# Altium schematic sheet Sheet2.SchDoc
size B
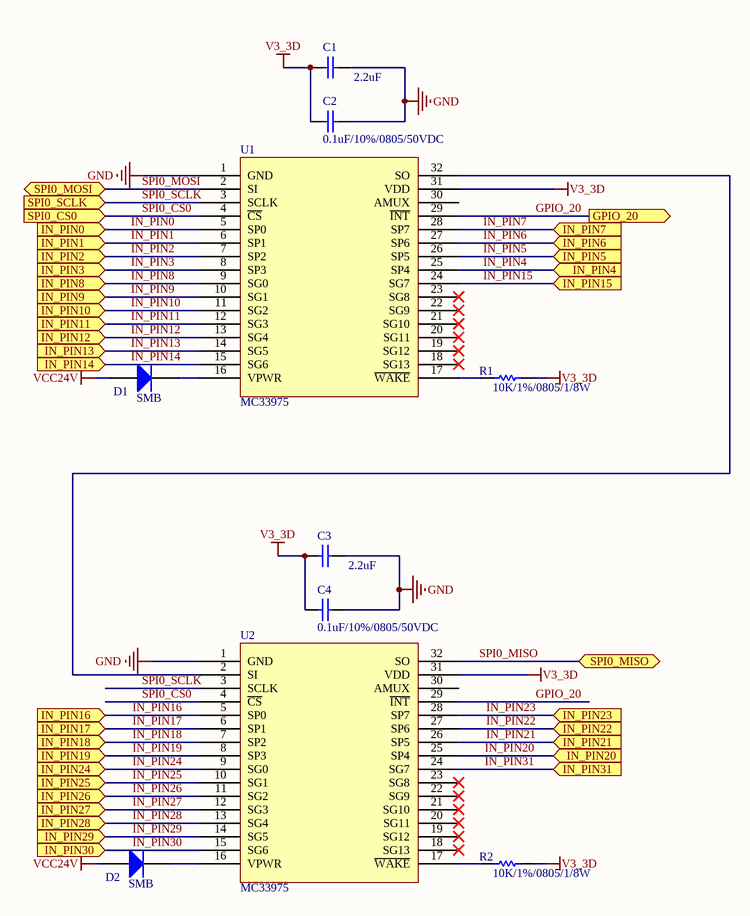
[diagram p0: Sheet2.SchDoc]

## Parts
C1  2.2uF  [0805_cap]
C2  0.1uF/10%/0805/50VDC  [0805_cap]
C3  2.2uF  [0805_cap]
C4  0.1uF/10%/0805/50VDC  [0805_cap]
D1  SMB  [SMB]
D2  SMB  [SMB]
R1  10K/1%/0805/1/8W  [0805]
R2  10K/1%/0805/1/8W  [0805]
U1  MC33975  [SOIC-32]
U2  MC33975  [SOIC-32]

## Ports
GPIO_20 (out), IN_PIN0 (in), IN_PIN1 (in), IN_PIN2 (in), IN_PIN3 (in), IN_PIN4 (in), IN_PIN5 (in), IN_PIN6 (in), IN_PIN7 (in), IN_PIN8 (in), IN_PIN9 (in), IN_PIN10 (in), IN_PIN11 (in), IN_PIN12 (in), IN_PIN13 (in), IN_PIN14 (in), IN_PIN15 (in), IN_PIN16 (in), IN_PIN17 (in), IN_PIN18 (in), IN_PIN19 (in), IN_PIN20 (in), IN_PIN21 (in), IN_PIN22 (in), IN_PIN23 (in), IN_PIN24 (in), IN_PIN25 (in), IN_PIN26 (in), IN_PIN27 (in), IN_PIN28 (in), IN_PIN29 (in), IN_PIN30 (in), IN_PIN31 (in), SPI0_CS0 (in), SPI0_MISO (bidir), SPI0_MOSI (bidir), SPI0_SCLK (in)

## Nets
GND: C1.1 C2.1 C3.1 C4.1 U1.1(GND) U2.1(GND)
V3_3D: C1.2 C2.2 C3.2 C4.2 R1.1 R2.1 U1.31(VDD) U2.31(VDD)
VCC24V: D1.1(A) D2.1(A)
GPIO_20: U1.29(~{INT}) U2.29(~{INT}) ; port GPIO_20
IN_PIN0: U1.5(SP0) ; port IN_PIN0
IN_PIN1: U1.6(SP1) ; port IN_PIN1
IN_PIN2: U1.7(SP2) ; port IN_PIN2
IN_PIN3: U1.8(SP3) ; port IN_PIN3
IN_PIN4: U1.25(SP4) ; port IN_PIN4
IN_PIN5: U1.26(SP5) ; port IN_PIN5
IN_PIN6: U1.27(SP6) ; port IN_PIN6
IN_PIN7: U1.28(SP7) ; port IN_PIN7
IN_PIN8: U1.9(SG0) ; port IN_PIN8
IN_PIN9: U1.10(SG1) ; port IN_PIN9
IN_PIN10: U1.11(SG2) ; port IN_PIN10
IN_PIN11: U1.12(SG3) ; port IN_PIN11
IN_PIN12: U1.13(SG4) ; port IN_PIN12
IN_PIN13: U1.14(SG5) ; port IN_PIN13
IN_PIN14: U1.15(SG6) ; port IN_PIN14
IN_PIN15: U1.24(SG7) ; port IN_PIN15
IN_PIN16: U2.5(SP0) ; port IN_PIN16
IN_PIN17: U2.6(SP1) ; port IN_PIN17
IN_PIN18: U2.7(SP2) ; port IN_PIN18
IN_PIN19: U2.8(SP3) ; port IN_PIN19
IN_PIN20: U2.25(SP4) ; port IN_PIN20
IN_PIN21: U2.26(SP5) ; port IN_PIN21
IN_PIN22: U2.27(SP6) ; port IN_PIN22
IN_PIN23: U2.28(SP7) ; port IN_PIN23
IN_PIN24: U2.9(SG0) ; port IN_PIN24
IN_PIN25: U2.10(SG1) ; port IN_PIN25
IN_PIN26: U2.11(SG2) ; port IN_PIN26
IN_PIN27: U2.12(SG3) ; port IN_PIN27
IN_PIN28: U2.13(SG4) ; port IN_PIN28
IN_PIN29: U2.14(SG5) ; port IN_PIN29
IN_PIN30: U2.15(SG6) ; port IN_PIN30
IN_PIN31: U2.24(SG7) ; port IN_PIN31
SPI0_CS0: U1.4(~{CS}) U2.4(~{CS}) ; port SPI0_CS0
SPI0_MISO: U2.32(SO) ; port SPI0_MISO
SPI0_MOSI: U1.2(SI) ; port SPI0_MOSI
SPI0_SCLK: U1.3(SCLK) U2.3(SCLK) ; port SPI0_SCLK
NetD1_2: D1.2(K) U1.16(VPWR)
NetD2_2: D2.2(K) U2.16(VPWR)
NetR1_2: R1.2 U1.17(~{WAKE})
NetR2_2: R2.2 U2.17(~{WAKE})
NetU1_32: U1.32(SO) U2.2(SI)

Not connected (* = marked no-connect by the designer): U1 18(SG13)* 19(SG12)* 20(SG11)* 21(SG10)* 22(SG9)* 23(SG8)* 30(AMUX); U2 18(SG13)* 19(SG12)* 20(SG11)* 21(SG10)* 22(SG9)* 23(SG8)* 30(AMUX)

## Library data of the parts
C1 C3 = Cap: Capacitor; Published: 8-Jun-2000; LatestRevisionDate: 17-Jul-2002; LatestRevisionNote: Re-released for DXP Platform.; PackageReference: RAD-0.3; Publisher: Altium Limited; Value: 2.2uF
C2 C4 = ASC-0024CA: 名称: 贴片电容; 型号: CGA4J2X8R1H104K125AA; 品牌: TDK; 规格: 0.1uF/10%/0805/50VDC
D1 D2 = Diode 1N5408: 3 Amp Medium Power Silicon Rectifier Diode; Published: 8-Jun-2000; LatestRevisionDate: 17-Jul-2002; LatestRevisionNote: Re-released for DXP Platform.; DatasheetVersion: Aug-1984; PackageReference: DO-201AD; Publisher: Altium Limited; PackageDescription: Diode, Axial; Body 9.5 x 5.3 mm (LxDia. max), Lead Dia. 1.32 mm (max); ComponentLink1Description: Manufacturer Link; ComponentLink1URL: http://www.irf.com/
R1 R2 = ASR-0030AA: Part Number: ASR-0028BA; 名称: 贴片电阻; 型号: RC0805FR-0710KL; 品牌: YAGEO; 规格: 10K/1%/0805/1/8W